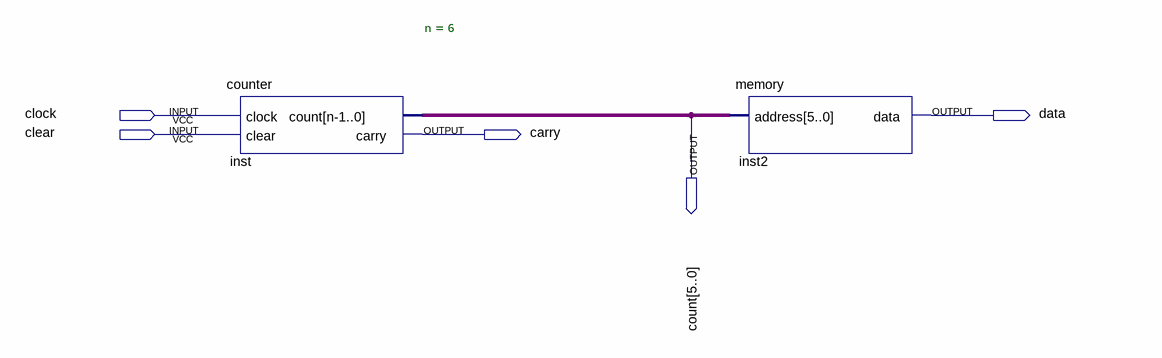
[diagram p0: schematic sheet]
// Quartus schematic memcount.bdf as structural Verilog: 2 symbols, 5 pins
module memcount (
  input  clock,
  input  clear,
  output [5:0] count,
  output data,
  output carry
);

  counter #(.n(6)) inst (.clock(clock), .clear(clear), .count(count), .carry(carry));
  memory inst2 (.address(count), .data(data));
endmodule
